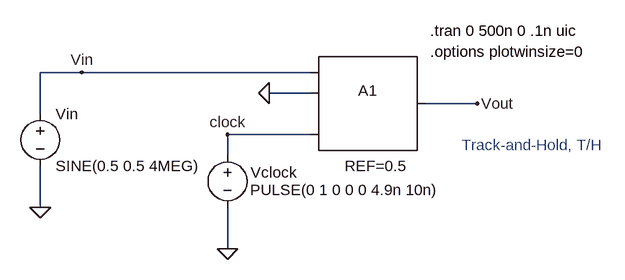
[diagram p0: schematic Fig28_5b.asc]
Fig28_5b.asc, the LTspice schematic file:
Version 4
SHEET 1 1344 696
WIRE 384 208 320 208
WIRE 736 208 384 208
WIRE 736 240 672 240
WIRE 992 256 912 256
WIRE 320 272 320 208
WIRE 736 304 608 304
WIRE 608 336 608 304
WIRE 320 416 320 352
WIRE 608 480 608 416
FLAG 320 416 0
FLAG 384 208 Vin
FLAG 608 480 0
FLAG 608 304 clock
FLAG 992 256 Vout
FLAG 672 240 0
SYMBOL voltage 320 256 R0
WINDOW 123 0 0 Left 0
WINDOW 39 0 0 Left 0
SYMATTR InstName Vin
SYMATTR Value SINE(0.5 0.5 4MEG)
SYMBOL voltage 608 320 R0
WINDOW 0 36 42 Left 0
WINDOW 3 35 69 Left 0
WINDOW 123 0 0 Left 0
WINDOW 39 0 0 Left 0
SYMATTR InstName Vclock
SYMATTR Value PULSE(0 1 0 0 0 4.9n 10n)
SYMBOL SpecialFunctions\\sample 816 240 R0
WINDOW 3 -28 112 Left 0
SYMATTR Value REF=0.5
SYMATTR InstName A1
TEXT 920 144 Left 0 !.tran 0 500n 0 .1n uic
TEXT 920 176 Left 0 !.options plotwinsize=0
TEXT 968 320 Left 0 ;Track-and-Hold, T/H

The netlist it stands for:
* Fig28_5b.asc
Vin Vin 0 SINE(0.5 0.5 4MEG)
Vclock clock 0 PULSE(0 1 0 0 0 4.9n 10n)
A1 Vin 0 0 clock 0 0 Vout 0 SAMPLEHOLD REF=0.5
.tran 0 500n 0 .1n uic
.options plotwinsize=0
* Track-and-Hold, T/H
.backanno
.end